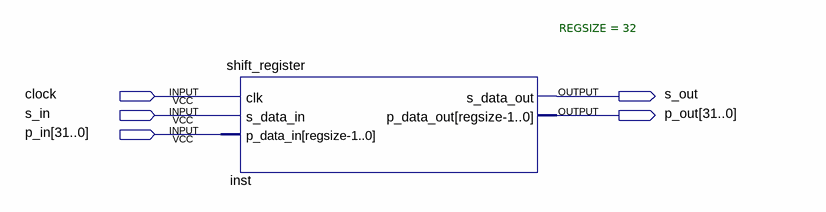
[diagram p0: schematic sheet]
// Quartus schematic shift_register_test.bdf as structural Verilog: 1 symbols, 5 pins
module shift_register_test (
  input  clock,
  input  s_in,
  input  [31:0] p_in,
  output s_out,
  output [31:0] p_out
);

  shift_register #(.REGSIZE(32)) inst (
    .clk(clock), .s_data_in(s_in), .p_data_in(p_in), .s_data_out(s_out), .p_data_out(p_out));
endmodule
